# Altium schematic sheet DBoard_conn.SchDoc: {Наименование}
size 420 x 297 mm; DocumentNumber: ПЛАС.ХХХХХХ.ХХХ ХХ; SheetNumber: {}; SheetTotal: {}; PageSetup: Record=PageOptions|CenterHorizontal=False|CenterVertical=False|PrintScale=0.95|XCorrection=0.00|YCorrection=0.00|PrintKind=1|BorderSize=5000000|LeftOffset=0|BottomOffset=0|Orientation=1|PaperLength=1000|PaperWidth=1000|Scale=100|PaperSource=15|PrintQuality=600|MediaType=1|DitherType=10|PaperKind=A4|PrintScaleMode=1; Rule: PcbType=ProtelPcb
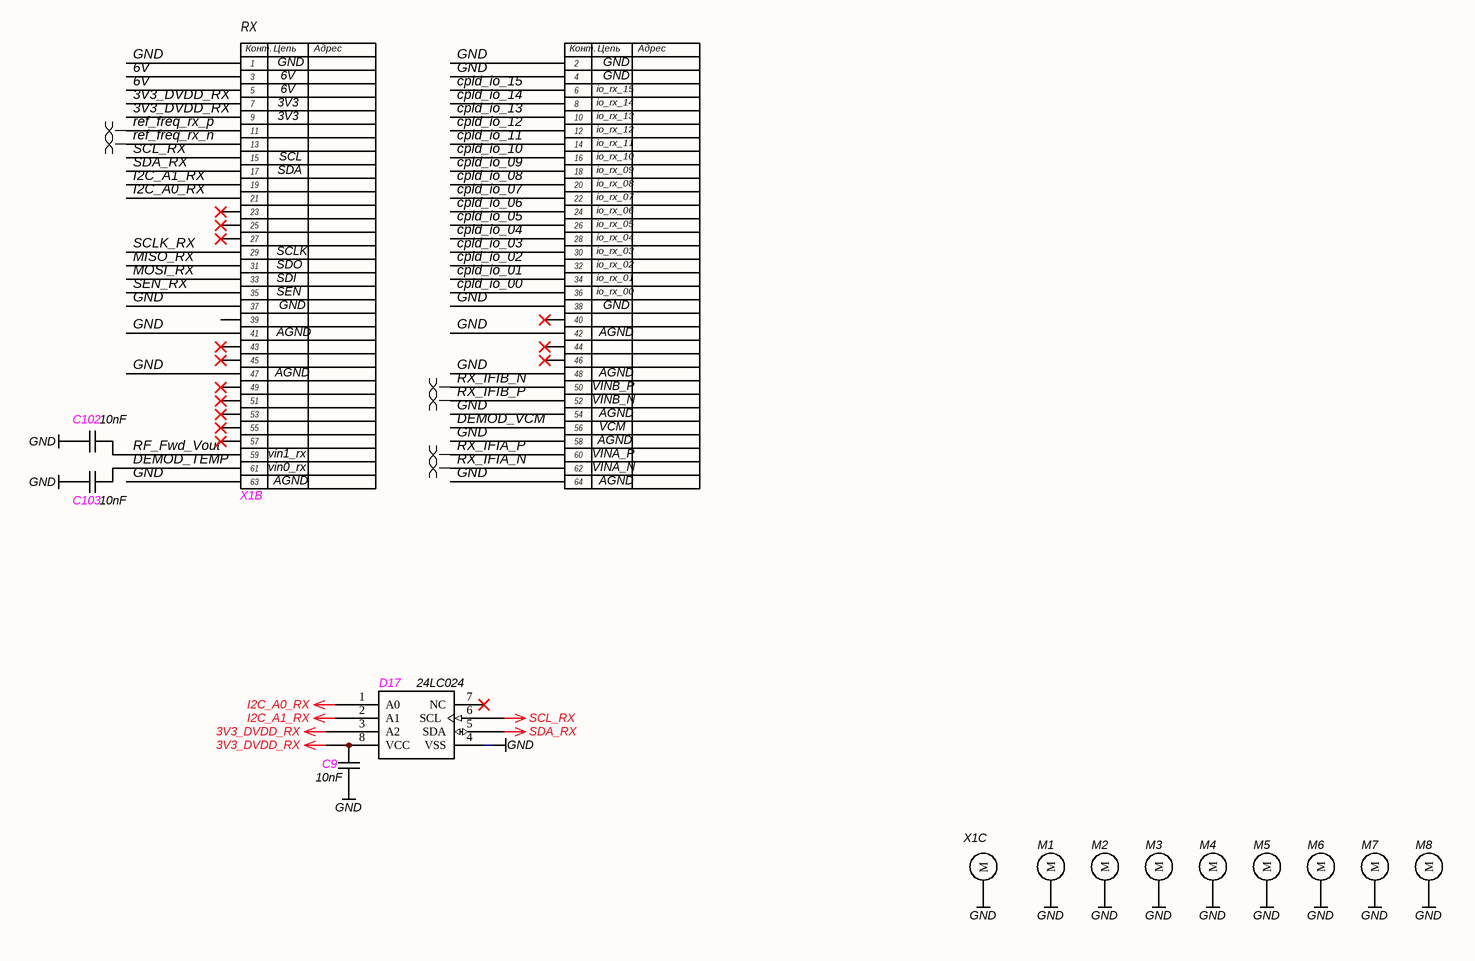
[diagram p0: DBoard_conn.SchDoc]

## Parts
C9  value 10nF  [C0402]  (hidden comment: CAP)
C102  value 10nF  [C0402]  (hidden comment: CAP)
C103  value 10nF  [C0402]  (hidden comment: CAP)
D17  24LC024  [SOIC_SN8]
M1  Via  [Mechanical_Via_2.6x4.2]  (value not drawn)
M2  Via  [Mechanical_Via_2.6x4.2]  (value not drawn)
M3  Via  [Mechanical_Via_2.6x4.2]  (value not drawn)
M4  Via  [Mechanical_Via_2.6x4.2]  (value not drawn)
M5  Via  [Mechanical_Via_2.6x4.2]  (value not drawn)
M6  Via  [Mechanical_Via_2.6x4.2]  (value not drawn)
M7  Via  [Mechanical_Via_2.6x4.2]  (value not drawn)
M8  Via  [Mechanical_Via_2.6x4.2]  (value not drawn)
X1  DBoard  [DBoard - half - MB]  (value not drawn)  (parts B,C of 3)

## Nets
3V3_DVDD_RX: C9.2 D17.3(A2) D17.8(VCC) X1.71(7) X1.73(9)
GND: C9.1 C102.1 C103.1 D17.4(VSS) M1.0(M) M2.0(M) M3.0(M) M4.0(M) M5.0(M) M6.0(M) M7.0(M) M8.0(M) X1.0(M) X1.65(1) X1.66(2) X1.68(4) X1.101(37) X1.102(38) X1.105(41) X1.106(42) X1.111(47) X1.112(48) X1.118(54) X1.122(58) X1.127(63) X1.128(64)
I2C_A0_RX: D17.1(A0) X1.85(21)
I2C_A1_RX: D17.2(A1) X1.83(19)
SCL_RX: D17.6(SCL) X1.79(15)
SDA_RX: D17.5(SDA) X1.81(17)
6V: X1.67(3) X1.69(5)
cpld_io_00: X1.100(36)
cpld_io_01: X1.98(34)
cpld_io_02: X1.96(32)
cpld_io_03: X1.94(30)
cpld_io_04: X1.92(28)
cpld_io_05: X1.90(26)
cpld_io_06: X1.88(24)
cpld_io_07: X1.86(22)
cpld_io_08: X1.84(20)
cpld_io_09: X1.82(18)
cpld_io_10: X1.80(16)
cpld_io_11: X1.78(14)
cpld_io_12: X1.76(12)
cpld_io_13: X1.74(10)
cpld_io_14: X1.72(8)
cpld_io_15: X1.70(6)
DEMOD_TEMP: C103.2 X1.125(61)
DEMOD_VCM: X1.120(56)
MISO_RX: X1.95(31)
MOSI_RX: X1.97(33)
ref_freq_rx_n: X1.77(13)
ref_freq_rx_p: X1.75(11)
RF_Fwd_Vout: C102.2 X1.123(59)
RX_IFIA_N: X1.126(62)
RX_IFIA_P: X1.124(60)
RX_IFIB_N: X1.114(50)
RX_IFIB_P: X1.116(52)
SCLK_RX: X1.93(29)
SEN_RX: X1.99(35)

Not connected (* = marked no-connect by the designer): D17 7(NC)*; X1 87(23)* 89(25)* 91(27)* 103(39) 104(40)* 107(43)* 108(44)* 109(45)* 110(46)* 113(49)* 115(51)* 117(53)* 119(55)* 121(57)*

## Layout directives
differential pair: ref_freq_rx_n, ref_freq_rx_p, RX_IFIA_N, RX_IFIA_P, RX_IFIB_N, RX_IFIB_P

## Notes on the sheet
- (near X1) GND
- (near X1) 3V3
- (near X1) 6V
- (near X1) io_rx_15
- (near X1) io_rx_14
- (near X1) SDA
- (near X1) SCL
- (near X1) io_rx_13
- (near X1) io_rx_12
- (near X1) io_rx_11
- (near X1) io_rx_10
- (near X1) io_rx_09
- (near X1) io_rx_08
- (near X1) io_rx_07
- (near X1) io_rx_06
- (near X1) io_rx_05
- (near X1) io_rx_04
- (near X1) SCLK
- (near X1) SDO
- (near X1) SDI
- (near X1) SEN
- (near X1) io_rx_03
- (near X1) io_rx_02
- (near X1) io_rx_01
- (near X1) io_rx_00
- (near X1) AGND
- (near X1) VINB_P
- (near X1) VINB_N
- (near X1) VCM
- (near X1) vin1_rx
- (near X1) vin0_rx
- (near X1) VINA_P
- (near X1) VINA_N
- Подп. и дата
- Инв. № дубл.
- Взам. инв. №
- Инв. № подл.
- Лист
- Изм.
- № докум.
- Подп.
- Дата
- Копировал
- Формат А3
- (in symbol DBoard, part B) RX; Конт.; Цепь; Адрес

## Library data of the parts
C9 C102 C103 = CAP: SMD Capacitor; Manufacturer: Murata; Material: X7R; Tolerance: 10%; Voltage: 25V; Type: Ceramic Capacitor; P/N: GRM155R71E103KA01D; Supplier 1: Digi-key; Supplier Part Number 1: 490-1312-1-ND; Supplier 2: Mouser; Supplier Part Number 2: 81-GRM36X103K25; Supplier 3: Farnell; Supplier Part Number 3: *
D17 = 24LC024: I2C EEPROM; Manufacturer: Microchip; Capacity: 2kbit; Max Clock: 400 kHz; Voltage: 2.5-5.5V; P/N: 24LC024HT-I/SN; Name: 24LC024; Package: SOIC-8; Type: I2C EEPROM; Value: 24LC024; Supplier 1: Digi-key; Supplier Part Number 1: 24LC024HT-I/SNCT-ND; Supplier 2: Mouser; Supplier Part Number 2: 579-24LC024HT-I/SN; Supplier 3: Farnell; Supplier Part Number 3: *
M1-M8 = Mechanical Via: Supplier 4: Digi-key; Supplier Part Number 4: *; Supplier 5: Mouser; Supplier Part Number 5: *; Supplier 6: Farnell; Supplier Part Number 6: *
X1 = DBoard: USRP DBoard; Manufacturer: Molex; Name: 1.00mm Pitch Mezzanine 714390164; P/N: 714390164; Value: Molex 714390164; Supplier 1: Digi-key; Supplier Part Number 1: WM17201-ND; Supplier 2: Mouser; Supplier Part Number 2: 538-71439-0164; Supplier 3: Farnell; Supplier Part Number 3: *